# Altium project InterfacePCB.PrjPcb
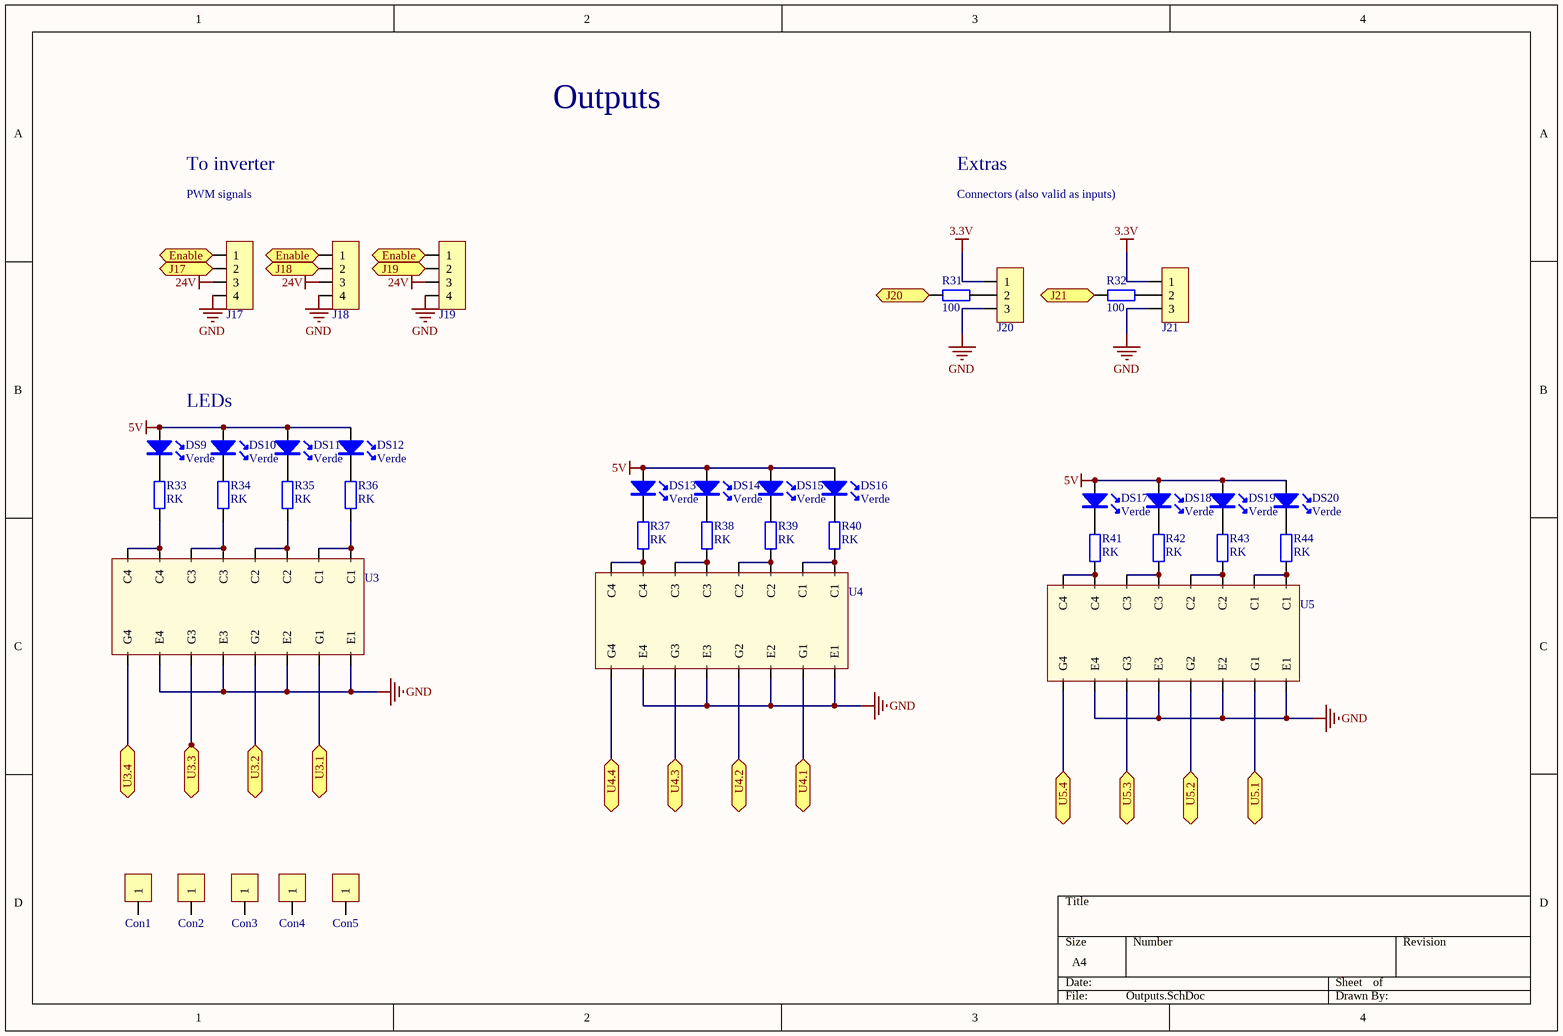
[diagram p0: Outputs.SchDoc]
6 sheets, 198 parts. Net scope: flat (ports and power ports of the same name join across sheets).
Board file: V2_PCB.PcbDoc
Sheets:
  Outputs.SchDoc
  Inputs.SchDoc
  InputsExtras.SchDoc
  DSP.SchDoc
  Supplies.SchDoc
  SignalProcessing.SchDoc

## Sheet Outputs.SchDoc
size A4

### Parts
Con1  CON1  [Support]  (value not drawn)
Con2  CON1  [Support]  (value not drawn)
Con3  CON1  [Support]  (value not drawn)
Con4  CON1  [Support]  (value not drawn)
Con5  CON1  [Support]  (value not drawn)
DS9  Verde  [LED_100mil]
DS10  Verde  [LED_100mil]
DS11  Verde  [LED_100mil]
DS12  Verde  [LED_100mil]
DS13  Verde  [LED_100mil]
DS14  Verde  [LED_100mil]
DS15  Verde  [LED_100mil]
DS16  Verde  [LED_100mil]
DS17  Verde  [LED_100mil]
DS18  Verde  [LED_100mil]
DS19  Verde  [LED_100mil]
DS20  Verde  [LED_100mil]
J17  Cleva 2 vias  [Con4_KK_256]  (value not drawn)
J18  Cleva 2 vias  [Con4_KK_256]  (value not drawn)
J19  Cleva 2 vias  [Con4_KK_256]  (value not drawn)
J20  Cleva 2 vias  [Con3_KK_256]  (value not drawn)
J21  Cleva 2 vias  [Con3_KK_256]  (value not drawn)
R31  100  [1206]
R32  100  [1206]
R33  RK  [1206]
R34  RK  [1206]
R35  RK  [1206]
R36  RK  [1206]
R37  RK  [1206]
R38  RK  [1206]
R39  RK  [1206]
R40  RK  [1206]
R41  RK  [1206]
R42  RK  [1206]
R43  RK  [1206]
R44  RK  [1206]
U3  MMPQ3904  [SO-16]  (value not drawn)
U4  MMPQ3904  [SO-16]  (value not drawn)
U5  MMPQ3904  [SO-16]  (value not drawn)

### Ports
Enable, J17, J18, J19, J20, J21, U3.1, U3.2, U3.3, U3.4, U4.1, U4.2, U4.3, U4.4, U5.1, U5.2, U5.3, U5.4

### Nets
3.3V: J20.1 J21.1
5V: DS9.A DS10.A DS11.A DS12.A DS13.A DS14.A DS15.A DS16.A DS17.A DS18.A DS19.A DS20.A
24V: J17.3 J18.3 J19.3
GND: J17.4 J18.4 J19.4 J20.3 J21.3 U3.10(E4) U3.12(E3) U3.14(E2) U3.16(E1) U4.10(E4) U4.12(E3) U4.14(E2) U4.16(E1) U5.10(E4) U5.12(E3) U5.14(E2) U5.16(E1)
NetDS9_K: DS9.K R33.1
NetDS10_K: DS10.K R34.1
NetDS11_K: DS11.K R35.1
NetDS12_K: DS12.K R36.1
NetDS13_K: DS13.K R37.1
NetDS14_K: DS14.K R38.1
NetDS15_K: DS15.K R39.1
NetDS16_K: DS16.K R40.1
NetDS17_K: DS17.K R41.1
NetDS18_K: DS18.K R42.1
NetDS19_K: DS19.K R43.1
NetDS20_K: DS20.K R44.1
NetDSP*1_5: U4.15(G1) ; port U4.1
NetDSP*1_7: U4.13(G2) ; port U4.2
NetDSP*1_8: U4.11(G3) ; port U4.3
NetDSP*1_9: U4.9(G4) ; port U4.4
NetDSP*1_11: U5.13(G2) ; port U5.2
NetDSP*1_12: U5.15(G1) ; port U5.1
NetDSP*1_13: U3.15(G1) ; port U3.1
NetDSP*1_14: U3.13(G2) ; port U3.2
NetDSP*1_15: U3.11(G3) ; port U3.3
NetDSP*1_18: U3.9(G4) ; port U3.4
NetDSP*1_34: U5.11(G3) ; port U5.3
NetDSP*1_35: U5.9(G4) ; port U5.4
NetDSP*1_36: J19.2 ; port J19
NetDSP*1_38: J18.2 ; port J18
NetDSP*1_40: J17.2 ; port J17
NetDSP*1_76: R31.1 ; port J20
NetDSP*1_77: R32.1 ; port J21
NetDSP*1_78: J17.1 J18.1 J19.1 ; port Enable
NetJ20_2: J20.2 R31.2
NetJ21_2: J21.2 R32.2
NetR33_2: R33.2 U3.7(C4) U3.8(C4)
NetR34_2: R34.2 U3.5(C3) U3.6(C3)
NetR35_2: R35.2 U3.3(C2) U3.4(C2)
NetR36_2: R36.2 U3.1(C1) U3.2(C1)
NetR37_2: R37.2 U4.7(C4) U4.8(C4)
NetR38_2: R38.2 U4.5(C3) U4.6(C3)
NetR39_2: R39.2 U4.3(C2) U4.4(C2)
NetR40_2: R40.2 U4.1(C1) U4.2(C1)
NetR41_2: R41.2 U5.7(C4) U5.8(C4)
NetR42_2: R42.2 U5.5(C3) U5.6(C3)
NetR43_2: R43.2 U5.3(C2) U5.4(C2)
NetR44_2: R44.2 U5.1(C1) U5.2(C1)

Not connected (* = marked no-connect by the designer): Con1 1; Con2 1; Con3 1; Con4 1; Con5 1

### Notes on the sheet
- Outputs
- To inverter
- Extras
- (near J17) PWM signals
- Connectors (also valid as inputs)
- LEDs

### Library data of the parts
DS9-DS20 = Led
J17-J19 = Con_4
J20 J21 = Con_3
R31-R44 = Resistencia: Potencia: 1/4W

## Sheet Inputs.SchDoc
size A4
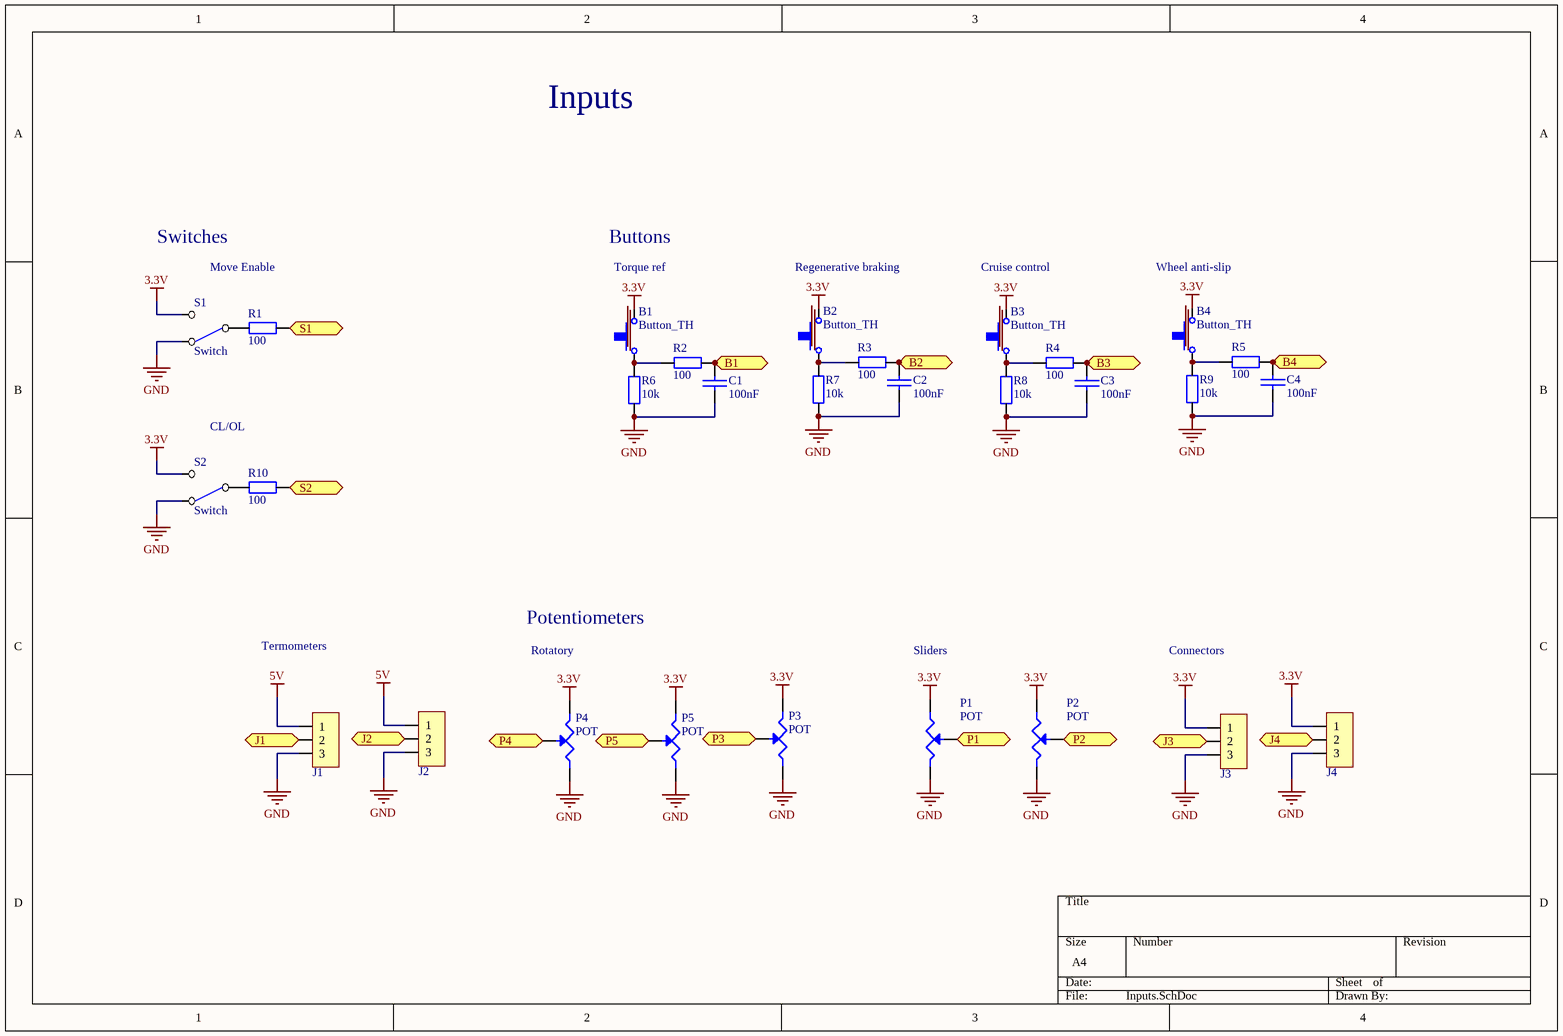
[diagram p1: Inputs.SchDoc]

### Parts
B1  Button_TH  [ButtonTH]
B2  Button_TH  [ButtonTH]
B3  Button_TH  [ButtonTH]
B4  Button_TH  [ButtonTH]
C1  100nF  [1206]
C2  100nF  [1206]
C3  100nF  [1206]
C4  100nF  [1206]
J1  Cleva 2 vias  [Con3_KK_256]  (value not drawn)
J2  Cleva 2 vias  [Con3_KK_256]  (value not drawn)
J3  Cleva 2 vias  [Con3_KK_256]  (value not drawn)
J4  Cleva 2 vias  [Con3_KK_256]  (value not drawn)
P1  POT  [SliderPot_PTA6044]
P2  POT  [SliderPot_PTA6044]
P3  POT  [POT_RK11K1140A3L]
P4  POT  [POT_RK11K1140A3L]
P5  POT  [POT_RK11K1140A3L]
R1  100  [1206]
R2  100  [1206]
R3  100  [1206]
R4  100  [1206]
R5  100  [1206]
R6  10k  [1206]
R7  10k  [1206]
R8  10k  [1206]
R9  10k  [1206]
R10  100  [1206]
S1  Switch  [SwitchTH_2Pos]
S2  Switch  [SwitchTH_2Pos]

### Ports
B1, B2, B3, B4, J1, J2, J3, J4, P1, P2, P3, P4, P5, S1, S2

### Nets
3.3V: B1.0 B2.0 B3.0 B4.0 J3.1 J4.1 P1.1 P2.1 P3.3 P4.3 P5.3 S1.2(ON2) S2.2(ON2)
5V: J1.1 J2.1
GND: C1.2 C2.2 C3.2 C4.2 J1.3 J2.3 J3.3 J4.3 P1.3 P2.3 P3.1 P4.1 P5.1 R6.2 R7.2 R8.2 R9.2 S1.0(ON1) S2.0(ON1)
NetB1_1: B1.1 R2.2 R6.1
NetB2_1: B2.1 R3.2 R7.1
NetB3_1: B3.1 R4.2 R8.1
NetB4_1: B4.1 R5.2 R9.1
NetC1_1: C1.1 R2.1 ; port B1
NetC2_1: C2.1 R3.1 ; port B2
NetC3_1: C3.1 R4.1 ; port B3
NetC4_1: C4.1 R5.1 ; port B4
NetDSP*1_2: J1.2 ; port J1
NetDSP*1_23: J2.2 ; port J2
NetDSP*1_24: J3.2 ; port J3
NetDSP*1_25: J4.2 ; port J4
NetDSP*1_26: P3.2 ; port P3
NetDSP*1_27: P4.2 ; port P4
NetDSP*1_28: P5.2 ; port P5
NetDSP*1_29: P2.2 ; port P2
NetDSP*1_37: R10.2 ; port S2
NetDSP*1_39: R1.2 ; port S1
NetDSP*1_63: P1.2 ; port P1
NetR1_1: R1.1 S1.1(COMMON)
NetR10_1: R10.1 S2.1(COMMON)

### Notes on the sheet
- Inputs
- Switches
- Buttons
- Move Enable
- (near B1) Torque ref
- (near B2) Regenerative braking
- (near B3) Cruise control
- (near B4) Wheel anti-slip
- CL/OL
- Termometers
- Potentiometers
- Rotatory
- (near P1) Sliders
- Connectors

### Library data of the parts
C1-C4 = Condensador
J1-J4 = Con_3
P1-P5 = POT: POTENCIOMETRO
R1-R10 = Resistencia: Potencia: 1/4W

## Sheet InputsExtras.SchDoc
size A4
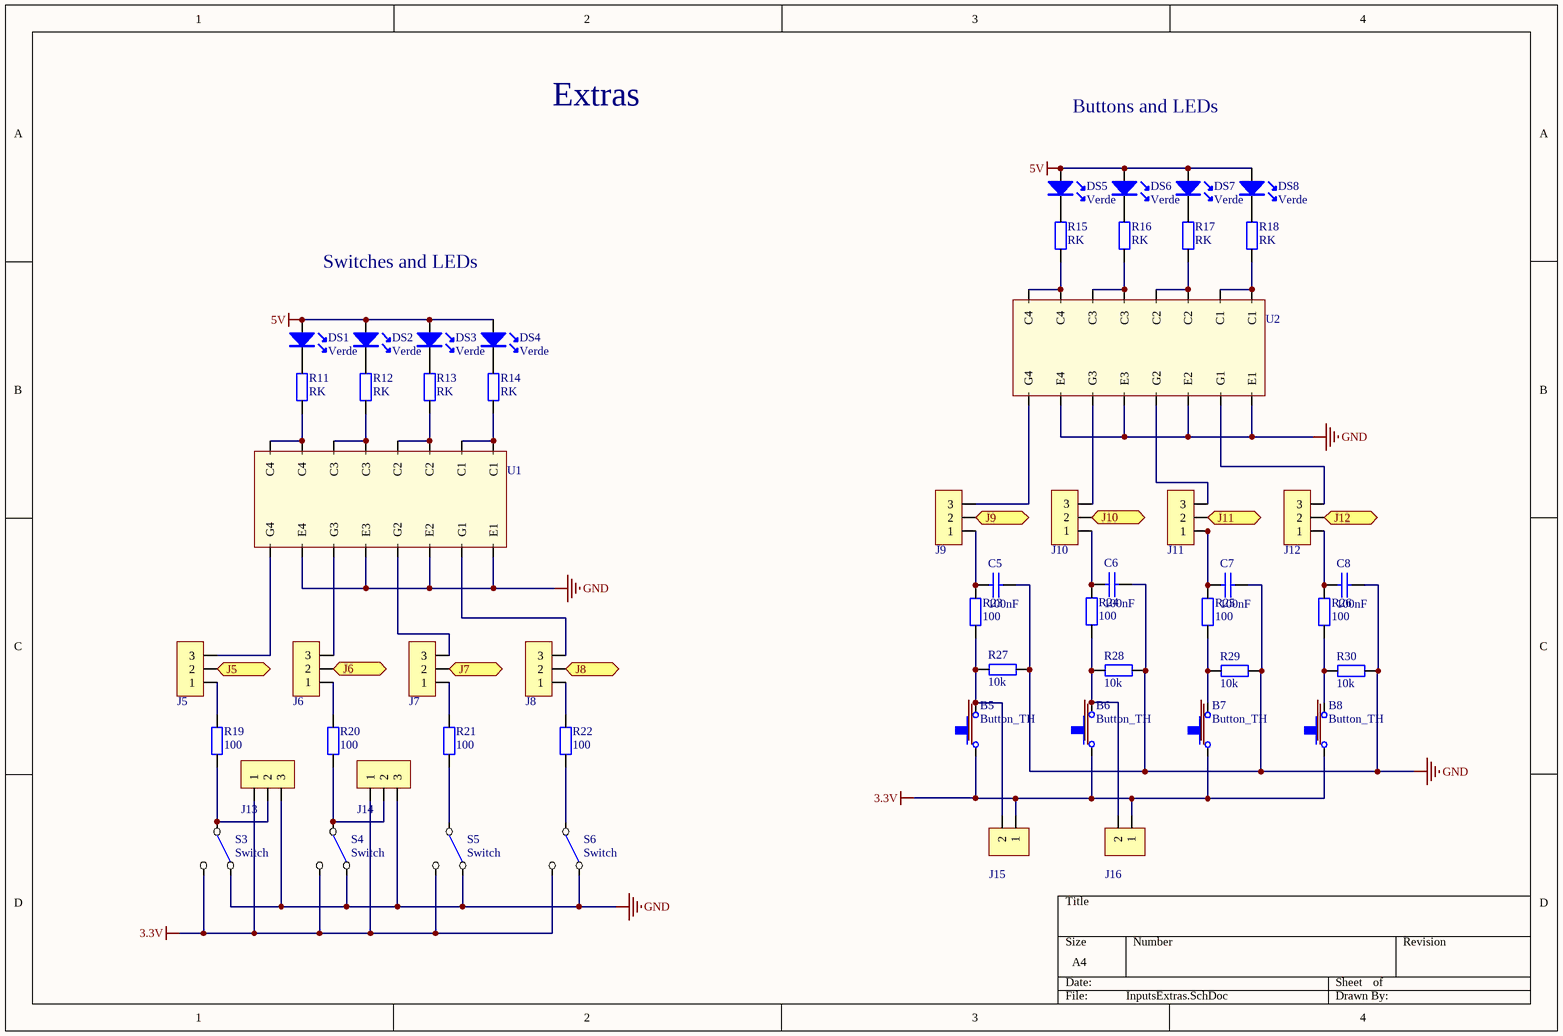
[diagram p2: InputsExtras.SchDoc]

### Parts
B5  Button_TH  [ButtonTH]
B6  Button_TH  [ButtonTH]
B7  Button_TH  [ButtonTH]
B8  Button_TH  [ButtonTH]
C5  100nF  [1206]
C6  100nF  [1206]
C7  100nF  [1206]
C8  100nF  [1206]
DS1  Verde  [LED_100mil]
DS2  Verde  [LED_100mil]
DS3  Verde  [LED_100mil]
DS4  Verde  [LED_100mil]
DS5  Verde  [LED_100mil]
DS6  Verde  [LED_100mil]
DS7  Verde  [LED_100mil]
DS8  Verde  [LED_100mil]
J5  Cleva 2 vias  [con_3_100milis]  (value not drawn)
J6  Cleva 2 vias  [con_3_100milis]  (value not drawn)
J7  Cleva 2 vias  [con_3_100milis]  (value not drawn)
J8  Cleva 2 vias  [con_3_100milis]  (value not drawn)
J9  Cleva 2 vias  [con_3_100milis]  (value not drawn)
J10  Cleva 2 vias  [con_3_100milis]  (value not drawn)
J11  Cleva 2 vias  [con_3_100milis]  (value not drawn)
J12  Cleva 2 vias  [con_3_100milis]  (value not drawn)
J13  Cleva 2 vias  [Con3_KK_256]  (value not drawn)
J14  Cleva 2 vias  [Con3_KK_256]  (value not drawn)
J15  Cleva 2 vias  [Con2_KK_256]  (value not drawn)
J16  Cleva 2 vias  [Con2_KK_256]  (value not drawn)
R11  RK  [1206]
R12  RK  [1206]
R13  RK  [1206]
R14  RK  [1206]
R15  RK  [1206]
R16  RK  [1206]
R17  RK  [1206]
R18  RK  [1206]
R19  100  [1206]
R20  100  [1206]
R21  100  [1206]
R22  100  [1206]
R23  100  [1206]
R24  100  [1206]
R25  100  [1206]
R26  100  [1206]
R27  10k  [1206]
R28  10k  [1206]
R29  10k  [1206]
R30  10k  [1206]
S3  Switch  [SwitchTH_2Pos]
S4  Switch  [SwitchTH_2Pos]
S5  Switch  [SwitchTH_2Pos]
S6  Switch  [SwitchTH_2Pos]
U1  MMPQ3904  [SO-16]  (value not drawn)
U2  MMPQ3904  [SO-16]  (value not drawn)

### Ports
J5, J6, J7, J8, J9, J10, J11, J12

### Nets
3.3V: B5.1 B6.1 B7.1 B8.1 J13.1 J14.1 J15.1 J16.1 S3.2(ON2) S4.2(ON2) S5.2(ON2) S6.2(ON2)
5V: DS1.A DS2.A DS3.A DS4.A DS5.A DS6.A DS7.A DS8.A
GND: C5.1 C6.1 C7.1 C8.1 J13.3 J14.3 R27.1 R28.1 R29.1 R30.1 S3.0(ON1) S4.0(ON1) S5.0(ON1) S6.0(ON1) U1.10(E4) U1.12(E3) U1.14(E2) U1.16(E1) U2.10(E4) U2.12(E3) U2.14(E2) U2.16(E1)
NetB5_0: B5.0 J15.2 R23.1 R27.2
NetB6_0: B6.0 J16.2 R24.1 R28.2
NetB7_0: B7.0 R25.1 R29.2
NetB8_0: B8.0 R26.1 R30.2
NetC5_2: C5.2 J9.1 R23.2
NetC6_2: C6.2 J10.1 R24.2
NetC7_2: C7.2 J11.1 R25.2
NetC8_2: C8.2 J12.1 R26.2
NetDS1_K: DS1.K R11.1
NetDS2_K: DS2.K R12.1
NetDS3_K: DS3.K R13.1
NetDS4_K: DS4.K R14.1
NetDS5_K: DS5.K R15.1
NetDS6_K: DS6.K R16.1
NetDS7_K: DS7.K R17.1
NetDS8_K: DS8.K R18.1
NetDSP*1_51: J6.2 ; port J6
NetDSP*1_52: J7.2 ; port J7
NetDSP*1_53: J8.2 ; port J8
NetDSP*1_54: J12.2 ; port J12
NetDSP*1_55: J11.2 ; port J11
NetDSP*1_58: J10.2 ; port J10
NetDSP*1_59: J9.2 ; port J9
NetDSP*1_75: J5.2 ; port J5
NetJ5_1: J5.1 R19.2
NetJ5_3: J5.3 U1.9(G4)
NetJ6_1: J6.1 R20.2
NetJ6_3: J6.3 U1.11(G3)
NetJ7_1: J7.1 R21.2
NetJ7_3: J7.3 U1.13(G2)
NetJ8_1: J8.1 R22.2
NetJ8_3: J8.3 U1.15(G1)
NetJ9_3: J9.3 U2.9(G4)
NetJ10_3: J10.3 U2.11(G3)
NetJ11_3: J11.3 U2.13(G2)
NetJ12_3: J12.3 U2.15(G1)
NetJ13_2: J13.2 R19.1 S3.1(COMMON)
NetJ14_2: J14.2 R20.1 S4.1(COMMON)
NetR11_2: R11.2 U1.7(C4) U1.8(C4)
NetR12_2: R12.2 U1.5(C3) U1.6(C3)
NetR13_2: R13.2 U1.3(C2) U1.4(C2)
NetR14_2: R14.2 U1.1(C1) U1.2(C1)
NetR15_2: R15.2 U2.7(C4) U2.8(C4)
NetR16_2: R16.2 U2.5(C3) U2.6(C3)
NetR17_2: R17.2 U2.3(C2) U2.4(C2)
NetR18_2: R18.2 U2.1(C1) U2.2(C1)
NetR21_1: R21.1 S5.1(COMMON)
NetR22_1: R22.1 S6.1(COMMON)

### Notes on the sheet
- Extras
- Buttons and LEDs
- Switches and LEDs

### Library data of the parts
C5-C8 = Condensador
DS1-DS8 = Led
J5-J14 = Con_3
J15 J16 = Con_2
R11-R30 = Resistencia: Potencia: 1/4W

## Sheet DSP.SchDoc
size A4
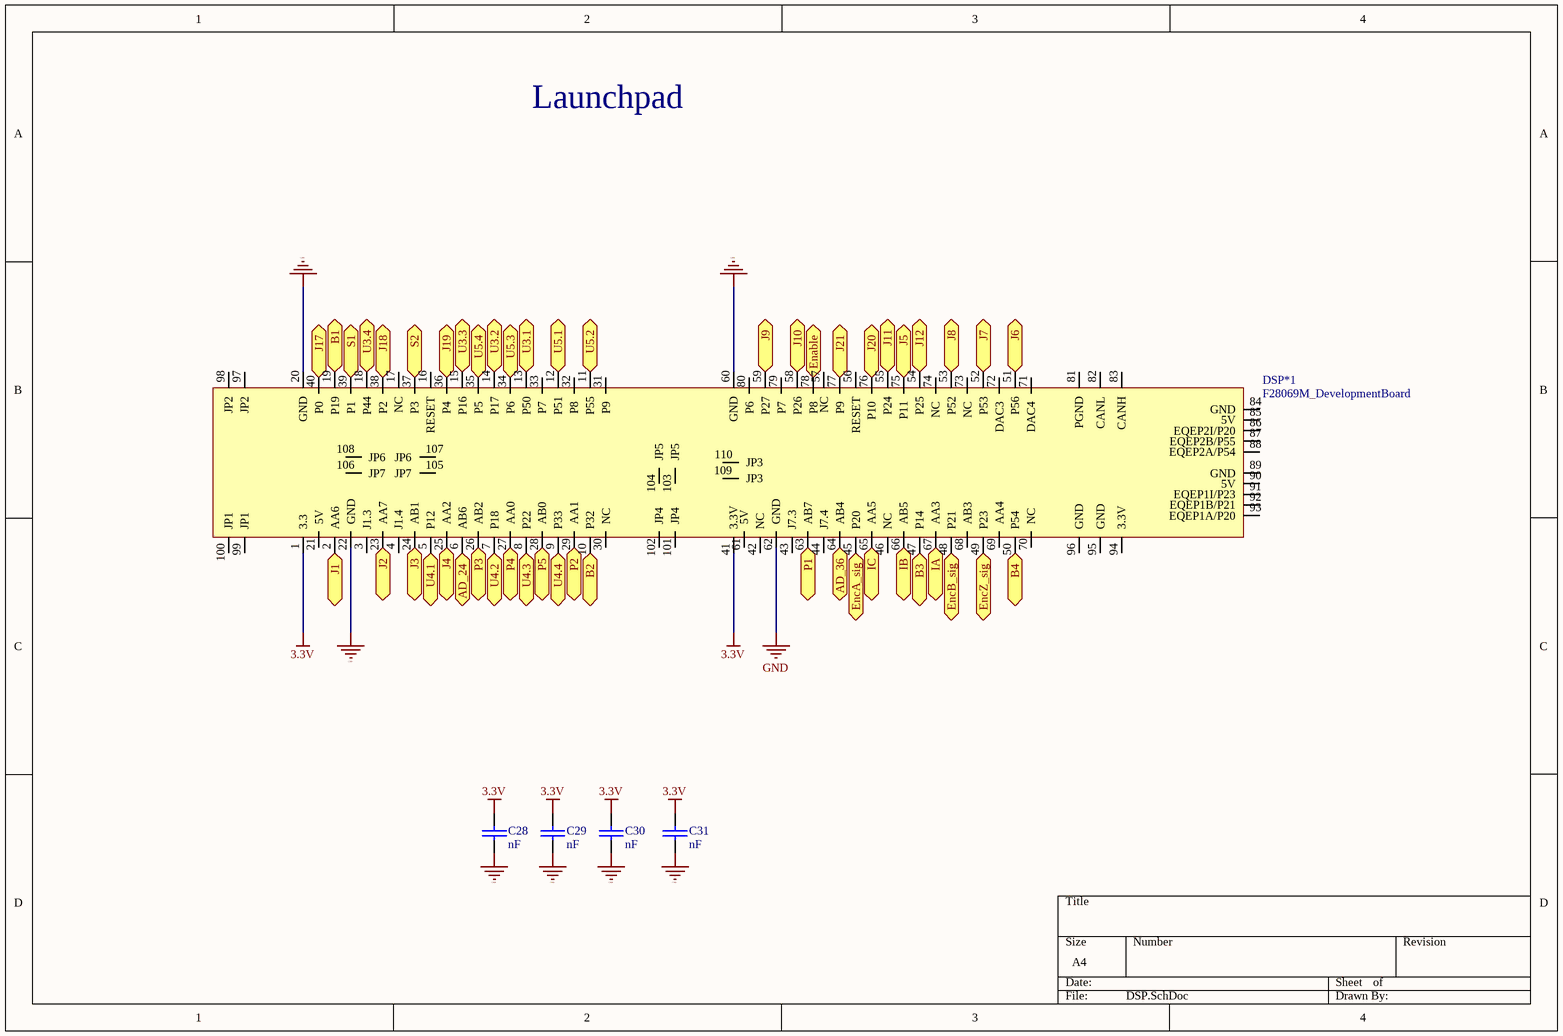
[diagram p3: DSP.SchDoc]

### Parts
C28  nF  [1206]
C29  nF  [1206]
C30  nF  [1206]
C31  nF  [1206]
DSP*1  F28069M_DevelopmentBoard  [F28069M_DevelopmentBoardDOWN]

### Ports
AD_24, AD_36, B1, B2, B3, B4, Enable, EncA_sig, EncB_sig, EncZ_sig, IA, IB, IC, J1, J2, J3, J4, J5, J6, J7, J8, J9, J10, J11, J12, J17, J18, J19, J20, J21, P1, P2, P3, P4, P5, S1, S2, U3.1, U3.2, U3.3, U3.4, U4.1, U4.2, U4.3, U4.4, U5.1, U5.2, U5.3, U5.4

### Nets
3.3V: C28.1 C29.1 C30.1 C31.1 DSP*1.1(3.3) DSP*1.41(3.3V)
GND: C28.2 C29.2 C30.2 C31.2 DSP*1.20(GND) DSP*1.22(GND) DSP*1.60(GND) DSP*1.62(GND)
ADC1: DSP*1.64(AB4) ; port AD_36
ADC2: DSP*1.6(AB6) ; port AD_24
ADC3: DSP*1.67(AA3) ; port IA
ADC4: DSP*1.66(AB5) ; port IB
ADC5: DSP*1.65(AA5) ; port IC
NetC1_1: DSP*1.19(P19) ; port B1
NetC2_1: DSP*1.10(P32) ; port B2
NetC3_1: DSP*1.47(P14) ; port B3
NetC4_1: DSP*1.50(P54) ; port B4
NetDSP*1_2: DSP*1.2(AA6) ; port J1
NetDSP*1_5: DSP*1.5(P12) ; port U4.1
NetDSP*1_7: DSP*1.7(P18) ; port U4.2
NetDSP*1_8: DSP*1.8(P22) ; port U4.3
NetDSP*1_9: DSP*1.9(P33) ; port U4.4
NetDSP*1_11: DSP*1.11(P55) ; port U5.2
NetDSP*1_12: DSP*1.12(P51) ; port U5.1
NetDSP*1_13: DSP*1.13(P50) ; port U3.1
NetDSP*1_14: DSP*1.14(P17) ; port U3.2
NetDSP*1_15: DSP*1.15(P16) ; port U3.3
NetDSP*1_18: DSP*1.18(P44) ; port U3.4
NetDSP*1_23: DSP*1.23(AA7) ; port J2
NetDSP*1_24: DSP*1.24(AB1) ; port J3
NetDSP*1_25: DSP*1.25(AA2) ; port J4
NetDSP*1_26: DSP*1.26(AB2) ; port P3
NetDSP*1_27: DSP*1.27(AA0) ; port P4
NetDSP*1_28: DSP*1.28(AB0) ; port P5
NetDSP*1_29: DSP*1.29(AA1) ; port P2
NetDSP*1_34: DSP*1.34(P6) ; port U5.3
NetDSP*1_35: DSP*1.35(P5) ; port U5.4
NetDSP*1_36: DSP*1.36(P4) ; port J19
NetDSP*1_37: DSP*1.37(P3) ; port S2
NetDSP*1_38: DSP*1.38(P2) ; port J18
NetDSP*1_39: DSP*1.39(P1) ; port S1
NetDSP*1_40: DSP*1.40(P0) ; port J17
NetDSP*1_45: DSP*1.45(P20) ; port EncA_sig
NetDSP*1_48: DSP*1.48(P21) ; port EncB_sig
NetDSP*1_49: DSP*1.49(P23) ; port EncZ_sig
NetDSP*1_51: DSP*1.51(P56) ; port J6
NetDSP*1_52: DSP*1.52(P53) ; port J7
NetDSP*1_53: DSP*1.53(P52) ; port J8
NetDSP*1_54: DSP*1.54(P25) ; port J12
NetDSP*1_55: DSP*1.55(P24) ; port J11
NetDSP*1_58: DSP*1.58(P26) ; port J10
NetDSP*1_59: DSP*1.59(P27) ; port J9
NetDSP*1_63: DSP*1.63(AB7) ; port P1
NetDSP*1_75: DSP*1.75(P11) ; port J5
NetDSP*1_76: DSP*1.76(P10) ; port J20
NetDSP*1_77: DSP*1.77(P9) ; port J21
NetDSP*1_78: DSP*1.78(P8) ; port Enable

Not connected (* = marked no-connect by the designer): DSP*1 3(J1.3) 4(J1.4) 16(RESET) 17(NC) 21(5V) 30(NC) 31(P9) 32(P8) 33(P7) 42(NC) 43(J7.3) 44(J7.4) 46(NC) 56(RESET) 57(NC) 61(5V) 68(AB3) 69(AA4) 70(NC) 71(DAC4) 72(DAC3) 73(NC) 74(NC) 79(P7) 80(P6) 81(PGND) 82(CANL) 83(CANH) 84(GND) 85(5V) 86(EQEP2I/P20) 87(EQEP2B/P55) 88(EQEP2A/P54) 89(GND) 90(5V) 91(EQEP1I/P23) 92(EQEP1B/P21) 93(EQEP1A/P20) 94(3.3V) 95(GND) 96(GND) 97(JP2) 98(JP2) 99(JP1) 100(JP1) 101(JP4) 102(JP4) 103(JP5) 104(JP5) 105(JP7) 106(JP7) 107(JP6) 108(JP6) 109(JP3) 110(JP3)

### Notes on the sheet
- Launchpad

### Library data of the parts
C28-C31 = Condensador

## Sheet Supplies.SchDoc
size A4
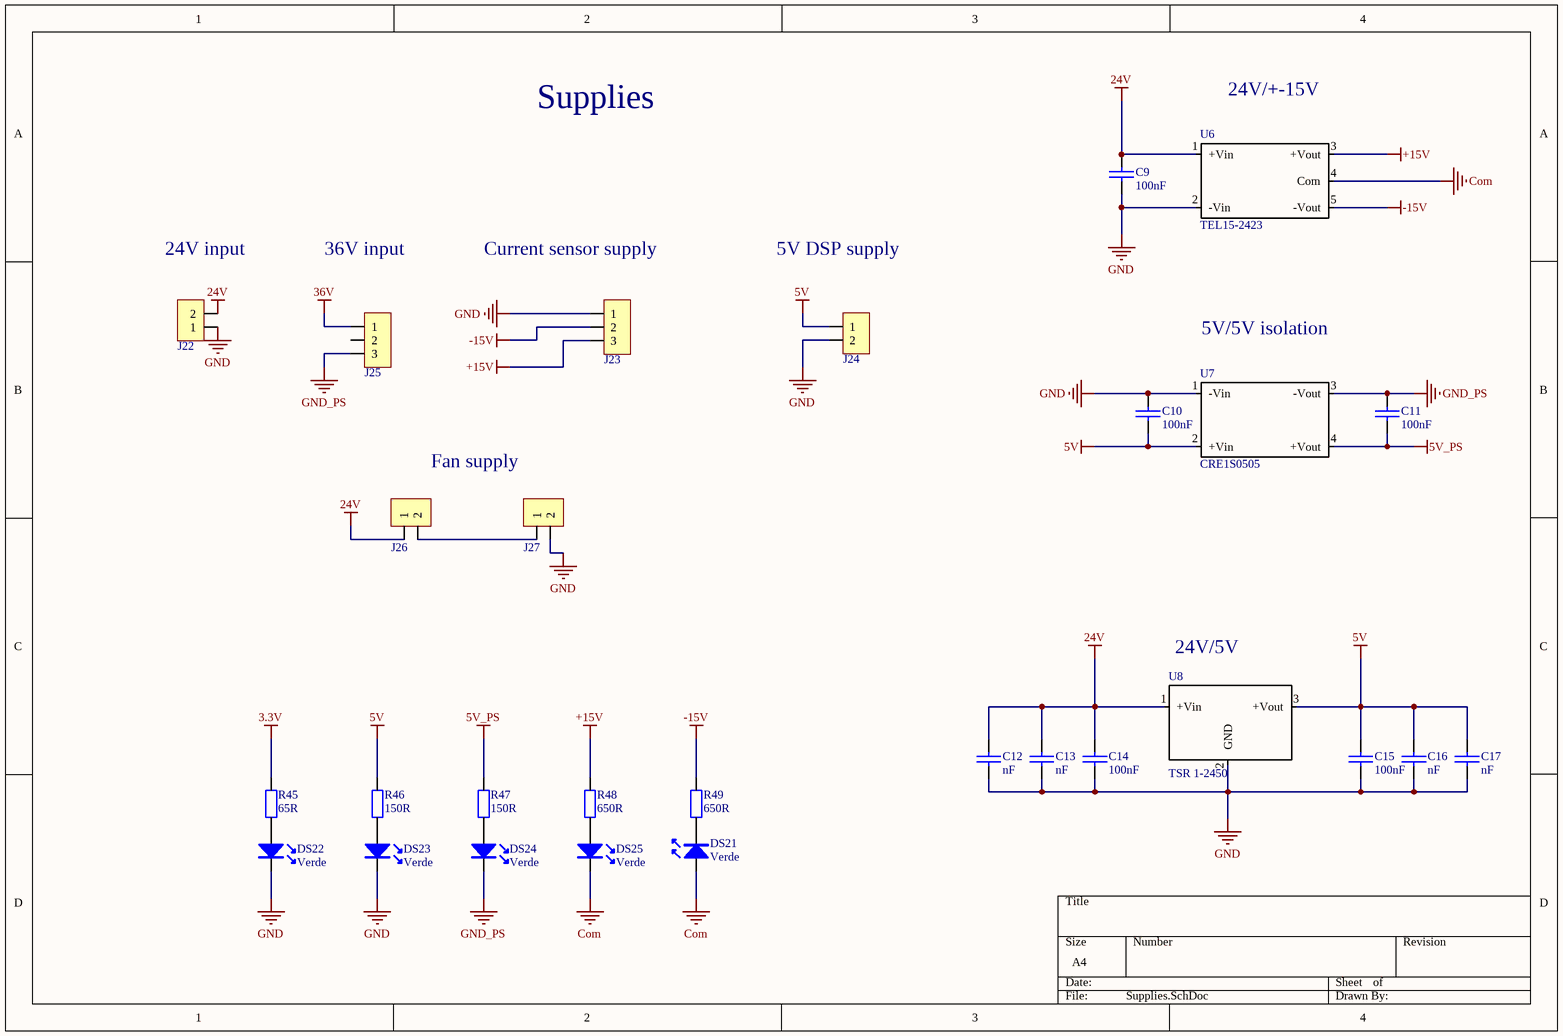
[diagram p4: Supplies.SchDoc]

### Parts
C9  100nF  [1206]
C10  100nF  [1206]
C11  100nF  [1206]
C12  nF  [1206]
C13  nF  [1206]
C14  100nF  [1206]
C15  100nF  [1206]
C16  nF  [1206]
C17  nF  [1206]
DS21  Verde  [LED_100mil]
DS22  Verde  [LED_100mil]
DS23  Verde  [LED_100mil]
DS24  Verde  [LED_100mil]
DS25  Verde  [LED_100mil]
J22  Cleva 2 vias  [Con2_ExtronSide_3.5mmPitch]  (value not drawn)
J23  Cur_meas_con  [Con3_KK_256]  (value not drawn)
J24  Cleva 2 vias  [Clema_2_vias]  (value not drawn)
J25  Cleva 2 vias  [Con3_150milPitch]  (value not drawn)
J26  Cleva 2 vias  [Con2_KK_256]  (value not drawn)
J27  Cleva 2 vias  [Con2_KK_256]  (value not drawn)
R45  65R  [1206]
R46  150R  [1206]
R47  150R  [1206]
R48  650R  [1206]
R49  650R  [1206]
U6  TEL15-2423  [TEL15-2423]
U7  CRE1S0505  [CRE1S0505SC]
U8  TSR 1-2450  [TSR 1-2450]

### Nets
3.3V: R45.1
5V: C10.2 C15.1 C16.1 C17.1 J24.1 R46.1 U7.2(+Vin) U8.3(+Vout)
5V_PS: C11.2 R47.1 U7.4(+Vout)
24V: C9.1 C12.1 C13.1 C14.1 J22.2 J26.1 U6.1(+Vin) U8.1(+Vin)
36V: J25.1
+15V: J23.3 R48.1 U6.3(+Vout)
-15V: J23.2 R49.1 U6.5(-Vout)
Com: DS21.A DS25.K U6.4(Com)
GND: C9.2 C10.1 C12.2 C13.2 C14.2 C15.2 C16.2 C17.2 DS22.K DS23.K J22.1 J23.1 J24.2 J27.2 U6.2(-Vin) U7.1(-Vin) U8.2(GND)
GND_PS: C11.1 DS24.K J25.3 U7.3(-Vout)
NetDS21_K: DS21.K R49.2
NetDS22_A: DS22.A R45.2
NetDS23_A: DS23.A R46.2
NetDS24_A: DS24.A R47.2
NetDS25_A: DS25.A R48.2
NetJ26_2: J26.2 J27.1

Not connected (* = marked no-connect by the designer): J25 2

### Notes on the sheet
- Supplies
- (near U6) 24V/+-15V
- (near J22) 24V input
- 36V input
- (near J23) Current sensor supply
- 5V DSP supply
- 5V/5V isolation
- Fan supply
- (near U8) 24V/5V

### Library data of the parts
C9-C17 = Condensador
DS21-DS25 = Led
J22 J24 J26 J27 = Con_2
J23 J25 = Con_3
R45-R49 = Resistencia: Potencia: 1/4W

## Sheet SignalProcessing.SchDoc
size A4
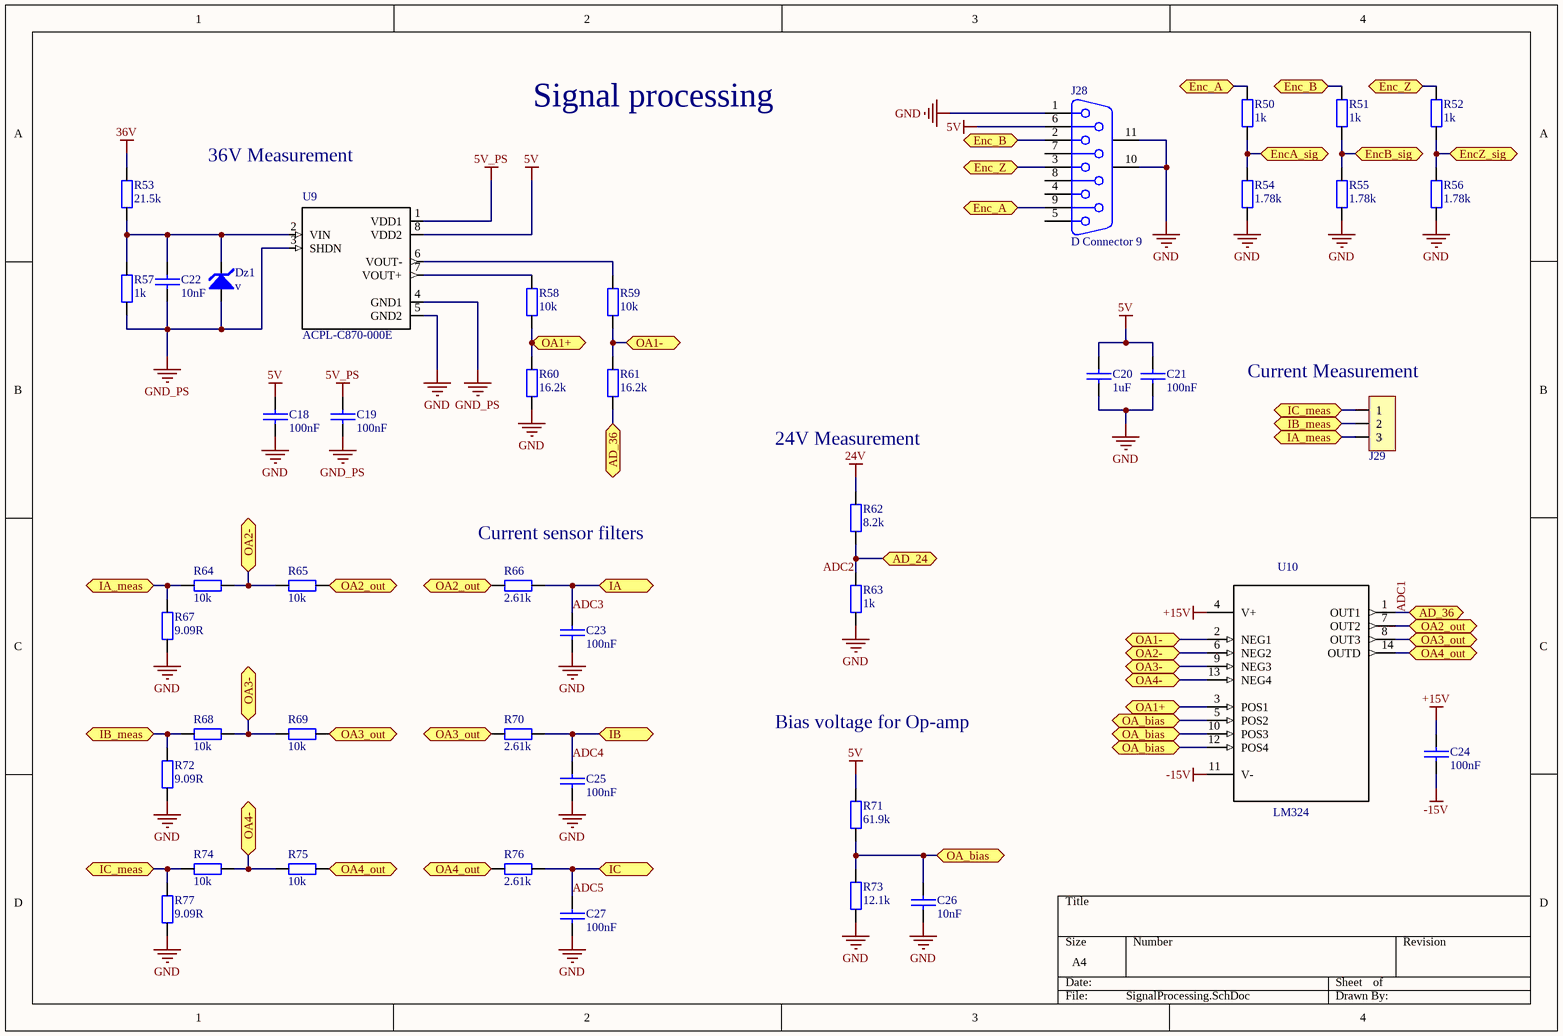
[diagram p5: SignalProcessing.SchDoc]

### Parts
C18  100nF  [1206]
C19  100nF  [1206]
C20  1uF  [1206]
C21  100nF  [1206]
C22  10nF  [1206]
C23  100nF  [1206]
C24  100nF  [1206]
C25  100nF  [1206]
C26  10nF  [1206]
C27  100nF  [1206]
Dz1  v  [Diodo]
J28  D Connector 9  [DSUB1.385-2H9]
J29  Cleva 2 vias  [Con3_KK_256]  (value not drawn)
R50  1k  [1206]
R51  1k  [1206]
R52  1k  [1206]
R53  21.5k  [1206]
R54  1.78k  [1206]
R55  1.78k  [1206]
R56  1.78k  [1206]
R57  1k  [1206]
R58  10k  [1206]
R59  10k  [1206]
R60  16.2k  [1206]
R61  16.2k  [1206]
R62  8.2k  [1206]
R63  1k  [1206]
R64  10k  [1206]
R65  10k  [1206]
R66  2.61k  [1206]
R67  9.09R  [1206]
R68  10k  [1206]
R69  10k  [1206]
R70  2.61k  [1206]
R71  61.9k  [1206]
R72  9.09R  [1206]
R73  12.1k  [1206]
R74  10k  [1206]
R75  10k  [1206]
R76  2.61k  [1206]
R77  9.09R  [1206]
U9  ACPL-C870-000E  [SOIC127P1150X360-8N]
U10  LM324  [SOIC_14]

### Ports
AD_24, AD_36, Enc_A, Enc_B, Enc_Z, EncA_sig, EncB_sig, EncZ_sig, IA, IA_meas, IB, IB_meas, IC, IC_meas, OA1+, OA1-, OA2-, OA2_out, OA3-, OA3_out, OA4-, OA4_out, OA_bias

### Nets
5V: C18.1 C20.2 C21.2 J28.6 R71.2 U9.8(VDD2)
5V_PS: C19.1 U9.1(VDD1)
24V: R62.1
36V: R53.2
+15V: C24.1 U10.4(V+)
-15V: C24.2 U10.11(V-)
GND: C18.2 C20.1 C21.1 C23.1 C25.2 C26.2 C27.1 J28.1 J28.10(MH1) J28.11(MH2) R54.1 R55.1 R56.1 R60.1 R63.1 R67.2 R72.2 R73.2 R77.1 U9.5(GND2)
GND_PS: C19.2 C22.2 Dz1.1(A) R57.2 U9.3(SHDN) U9.4(GND1)
ADC1: R61.1 U10.1(OUT1) ; port AD_36
ADC2: R62.2 R63.2 ; port AD_24
ADC3: C23.2 R66.2 ; port IA
ADC4: C25.1 R70.1 ; port IB
ADC5: C27.2 R76.2 ; port IC
NetC22_1: C22.1 Dz1.2(K) R53.1 R57.1 U9.2(VIN)
NetC26_1: C26.1 R71.1 R73.1 U10.5(POS2) U10.10(POS3) U10.12(POS4) ; port OA_bias
NetDSP*1_45: R50.1 R54.2 ; port EncA_sig
NetDSP*1_48: R51.1 R55.2 ; port EncB_sig
NetDSP*1_49: R52.1 R56.2 ; port EncZ_sig
NetJ28_2: J28.2 R51.2 ; port Enc_B
NetJ28_3: J28.3 R52.2 ; port Enc_Z
NetJ28_9: J28.9 R50.2 ; port Enc_A
NetJ29_1: J29.1 R74.2 R77.2 ; port IC_meas
NetJ29_2: J29.2 R68.1 R72.1 ; port IB_meas
NetJ29_3: J29.3 R64.1 R67.1 ; port IA_meas
NetR58_1: R58.1 R60.2 U10.3(POS1) ; port OA1+
NetR58_2: R58.2 U9.7(VOUT+)
NetR59_1: R59.1 R61.2 U10.2(NEG1) ; port OA1-
NetR59_2: R59.2 U9.6(VOUT-)
NetR64_2: R64.2 R65.2 U10.6(NEG2) ; port OA2-
NetR65_1: R65.1 R66.1 U10.7(OUT2) ; port OA2_out
NetR68_2: R68.2 R69.1 U10.9(NEG3) ; port OA3-
NetR69_2: R69.2 R70.2 U10.8(OUT3) ; port OA3_out
NetR74_1: R74.1 R75.2 U10.13(NEG4) ; port OA4-
NetR75_1: R75.1 R76.1 U10.14(OUTD) ; port OA4_out

Not connected (* = marked no-connect by the designer): J28 4 5 7 8

### Notes on the sheet
- Signal processing
- 36V Measurement
- (near J29) Current Measurement
- 24V Measurement
- (near R66) Current sensor filters
- Bias voltage for Op-amp

### Library data of the parts
C18-C27 = Condensador
Dz1 = Zener
J28 = D Connector 9: Receptacle Assembly, 9 Position, Right Angle; PackageDocument: O; Positions: 9; Published: 15-Jun-2001; LatestRevisionDate: 17-Jul-2002; LatestRevisionNote: Re-released for DXP Platform.; DatasheetDocument: 1-Sep-1999; PackageReference: 788750; Publisher: Altium Limited; Orientation: Right Angle; Gender: Receptacle
J29 = Con_3
R50-R77 = Resistencia: Potencia: 1/4W
U9 = ACPL-C870-000E: Isolation Amplifier [Broadcom] ACPL-C870-000E Isolation Amplifier; MF: Broadcom Limited; Package: SO-8 Broadcom; Digi-Key_Part_Number: 516-2578-5-ND; MP: ACPL-C870-000E; Digi-Key_Purchase_URL: https://www.digikey.dk/product-detail/en/broadcom-limited/ACPL-C870-000E/516-2578-5-ND/3523705?utm_source=snapeda&utm_medium=aggregator&utm_campaign=symbol; SnapEDA_Link: https://www.snapeda.com/parts/ACPL-C870-000E/Broadcom%20Limited/view-part/?ref=snap; Value: *
U10 = LMC6484IM_1: 14 pin CMOS Quad Rail to Rail Input and Output Operational Amplifier 55 per tube; MF: Texas Instruments; Price: None; MP: LMC6484IM; SnapEDA_Link: https://www.snapeda.com/parts/LMC6484IM/Texas%20Instruments/view-part/?ref=snap; Availability: Unavailable; Package: SOIC-14 Texas Instruments; Value: *

## Nets that join several sheets
3.3V: Outputs (J20.1 J21.1), Inputs (13 pins), InputsExtras (12 pins), DSP (6 pins), Supplies (R45.1)
5V: Outputs (12 pins), Inputs (J1.1 J2.1), InputsExtras (8 pins), Supplies (8 pins), SignalProcessing (6 pins)
5V_PS: Supplies (C11.2 R47.1 U7.4), SignalProcessing (C19.1 U9.1)
24V: Outputs (J17.3 J18.3 J19.3), Supplies (8 pins), SignalProcessing (R62.1)
36V: Supplies (J25.1), SignalProcessing (R53.2)
+15V: Supplies (J23.3 R48.1 U6.3), SignalProcessing (C24.1 U10.4)
-15V: Supplies (J23.2 R49.1 U6.5), SignalProcessing (C24.2 U10.11)
GND: Outputs (17 pins), Inputs (19 pins), InputsExtras (22 pins), DSP (8 pins), Supplies (17 pins), SignalProcessing (20 pins)
GND_PS: Supplies (C11.1 DS24.K J25.3 U7.3), SignalProcessing (6 pins)
ADC1: DSP (DSP*1.64), SignalProcessing (R61.1 U10.1)
ADC2: DSP (DSP*1.6), SignalProcessing (R62.2 R63.2)
ADC3: DSP (DSP*1.67), SignalProcessing (C23.2 R66.2)
ADC4: DSP (DSP*1.66), SignalProcessing (C25.1 R70.1)
ADC5: DSP (DSP*1.65), SignalProcessing (C27.2 R76.2)
NetC1_1: Inputs (C1.1 R2.1), DSP (DSP*1.19)
NetC2_1: Inputs (C2.1 R3.1), DSP (DSP*1.10)
NetC3_1: Inputs (C3.1 R4.1), DSP (DSP*1.47)
NetC4_1: Inputs (C4.1 R5.1), DSP (DSP*1.50)
NetDSP*1_2: Inputs (J1.2), DSP (DSP*1.2)
NetDSP*1_5: Outputs (U4.15), DSP (DSP*1.5)
NetDSP*1_7: Outputs (U4.13), DSP (DSP*1.7)
NetDSP*1_8: Outputs (U4.11), DSP (DSP*1.8)
NetDSP*1_9: Outputs (U4.9), DSP (DSP*1.9)
NetDSP*1_11: Outputs (U5.13), DSP (DSP*1.11)
NetDSP*1_12: Outputs (U5.15), DSP (DSP*1.12)
NetDSP*1_13: Outputs (U3.15), DSP (DSP*1.13)
NetDSP*1_14: Outputs (U3.13), DSP (DSP*1.14)
NetDSP*1_15: Outputs (U3.11), DSP (DSP*1.15)
NetDSP*1_18: Outputs (U3.9), DSP (DSP*1.18)
NetDSP*1_23: Inputs (J2.2), DSP (DSP*1.23)
NetDSP*1_24: Inputs (J3.2), DSP (DSP*1.24)
NetDSP*1_25: Inputs (J4.2), DSP (DSP*1.25)
NetDSP*1_26: Inputs (P3.2), DSP (DSP*1.26)
NetDSP*1_27: Inputs (P4.2), DSP (DSP*1.27)
NetDSP*1_28: Inputs (P5.2), DSP (DSP*1.28)
NetDSP*1_29: Inputs (P2.2), DSP (DSP*1.29)
NetDSP*1_34: Outputs (U5.11), DSP (DSP*1.34)
NetDSP*1_35: Outputs (U5.9), DSP (DSP*1.35)
NetDSP*1_36: Outputs (J19.2), DSP (DSP*1.36)
NetDSP*1_37: Inputs (R10.2), DSP (DSP*1.37)
NetDSP*1_38: Outputs (J18.2), DSP (DSP*1.38)
NetDSP*1_39: Inputs (R1.2), DSP (DSP*1.39)
NetDSP*1_40: Outputs (J17.2), DSP (DSP*1.40)
NetDSP*1_45: DSP (DSP*1.45), SignalProcessing (R50.1 R54.2)
NetDSP*1_48: DSP (DSP*1.48), SignalProcessing (R51.1 R55.2)
NetDSP*1_49: DSP (DSP*1.49), SignalProcessing (R52.1 R56.2)
NetDSP*1_51: InputsExtras (J6.2), DSP (DSP*1.51)
NetDSP*1_52: InputsExtras (J7.2), DSP (DSP*1.52)
NetDSP*1_53: InputsExtras (J8.2), DSP (DSP*1.53)
NetDSP*1_54: InputsExtras (J12.2), DSP (DSP*1.54)
NetDSP*1_55: InputsExtras (J11.2), DSP (DSP*1.55)
NetDSP*1_58: InputsExtras (J10.2), DSP (DSP*1.58)
NetDSP*1_59: InputsExtras (J9.2), DSP (DSP*1.59)
NetDSP*1_63: Inputs (P1.2), DSP (DSP*1.63)
NetDSP*1_75: InputsExtras (J5.2), DSP (DSP*1.75)
NetDSP*1_76: Outputs (R31.1), DSP (DSP*1.76)
NetDSP*1_77: Outputs (R32.1), DSP (DSP*1.77)
NetDSP*1_78: Outputs (J17.1 J18.1 J19.1), DSP (DSP*1.78)